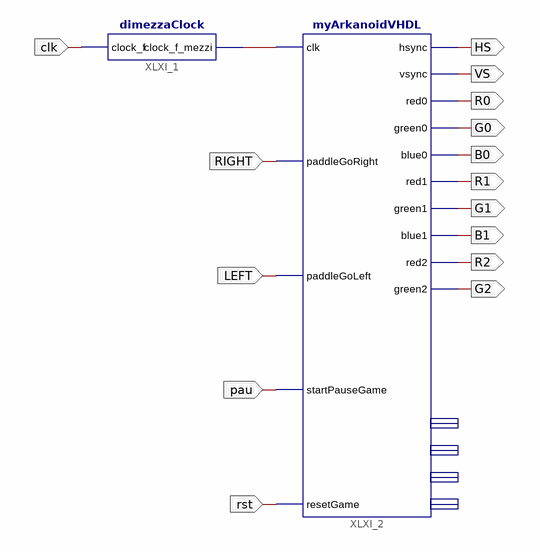
[diagram p0: schematic sheet 1]
// Xilinx ISE schematic Diagram.sch (spartan3e) as structural Verilog: 2 symbols, 15 ports
module Diagram (
  input  clk,
  input  RIGHT,
  input  LEFT,
  input  pau,
  input  rst,
  output HS,
  output VS,
  output R0,
  output G0,
  output B0,
  output R1,
  output G1,
  output B1,
  output R2,
  output G2
);

  wire XLXN_2;

  dimezzaClock XLXI_1 (.clock_f(clk), .clock_f_mezzi(XLXN_2));
  myArkanoidVHDL XLXI_2 (
    .clk(XLXN_2), .paddleGoRight(RIGHT), .paddleGoLeft(LEFT), .startPauseGame(pau), .resetGame(rst),
    .hsync(HS), .vsync(VS), .red0(R0), .green0(G0), .blue0(B0), .red1(R1), .green1(G1), .blue1(B1),
    .red2(R2), .green2(G2));  // open: leds1, leds2, leds3, leds4
endmodule
